# Altium schematic sheet PWM_Isolated.SchDoc: Isolation Motor Driver
size A4; PageSetup: Record=PageOptions|CenterHorizontal=True|CenterVertical=True|PrintScale=0.97|XCorrection=1.00|YCorrection=1.00|PrintKind=0|BorderSize=5000000|LeftOffset=0|BottomOffset=0|Orientation=2|PaperLength=1000|PaperWidth=1000|Scale=100|PaperSource=7|PrintQuality=-3|MediaType=1|DitherType=10|PrintScaleMode=1|PaperKind=A4|PaperIndex=9
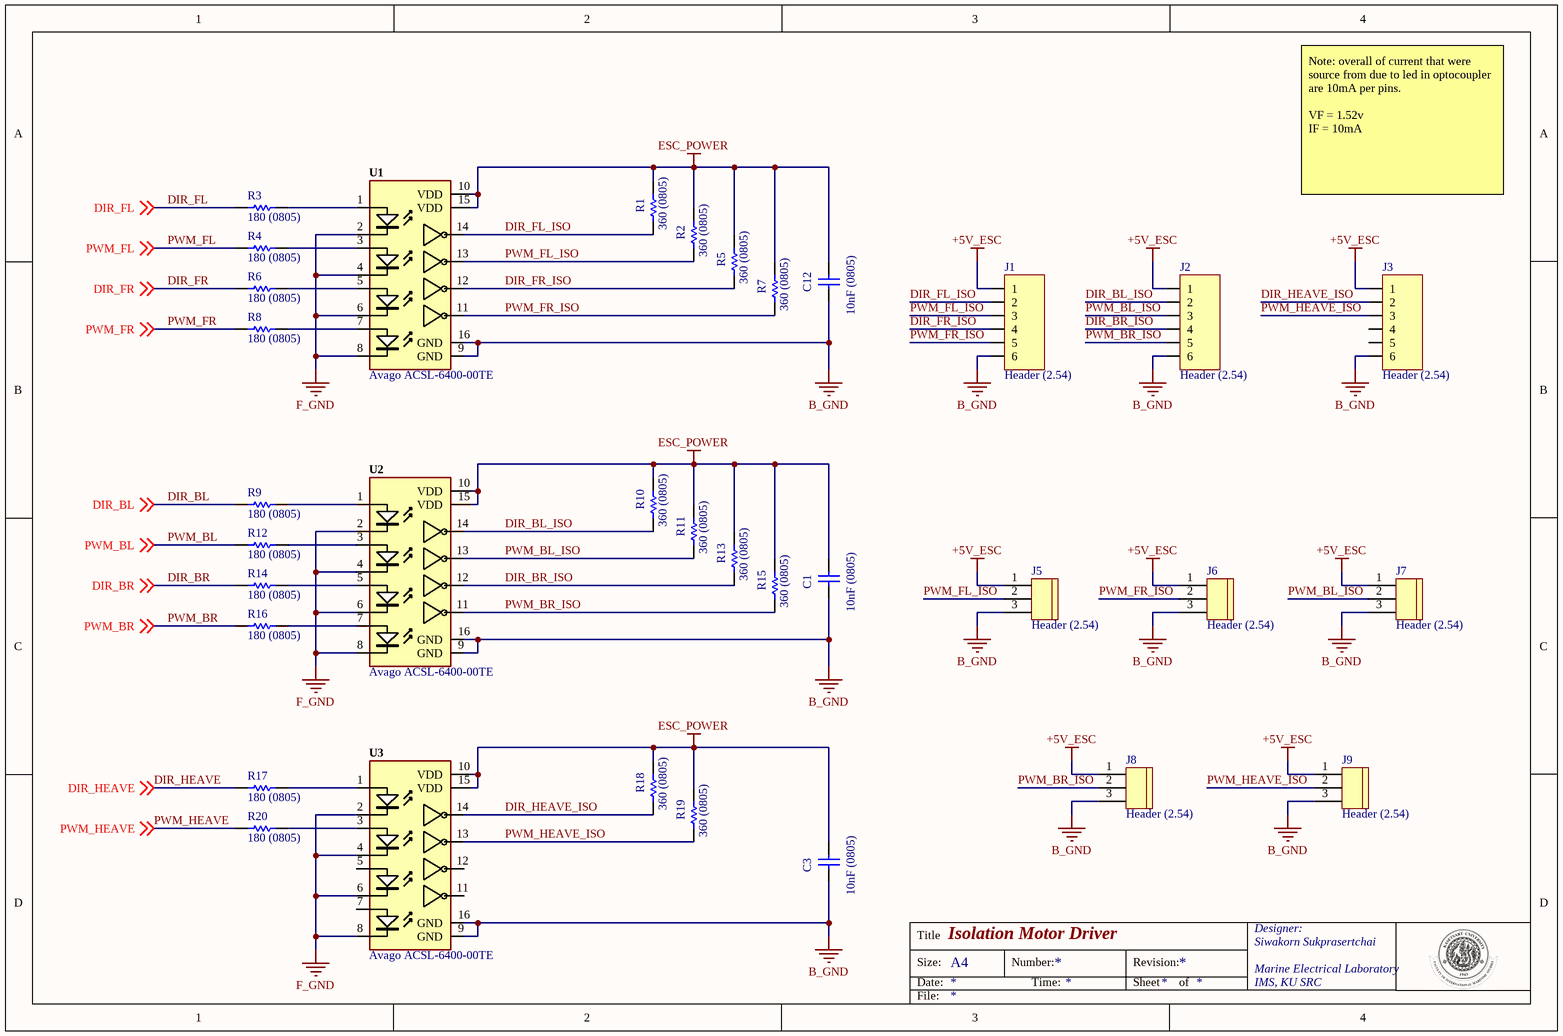
[diagram p0: PWM_Isolated.SchDoc]

## Parts
C1  10nF (0805)  [CAPC2013X94X50NL20T25]
C3  10nF (0805)  [CAPC2013X94X50NL20T25]
C12  10nF (0805)  [CAPC2013X94X50NL20T25]
J1  Header (2.54)  [PCB-cqg2o6bffgevoirlg0wu-1]
J2  Header (2.54)  [PCB-cqg2o6bffgevoirlg0wu-1]
J3  Header (2.54)  [PCB-cqg2o6bffgevoirlg0wu-1]
J5  Header (2.54)  [PCB-euxx5fdf5mehbg45u1ir-1]
J6  Header (2.54)  [PCB-euxx5fdf5mehbg45u1ir-1]
J7  Header (2.54)  [PCB-euxx5fdf5mehbg45u1ir-1]
J8  Header (2.54)  [PCB-euxx5fdf5mehbg45u1ir-1]
J9  Header (2.54)  [PCB-euxx5fdf5mehbg45u1ir-1]
R1  360 (0805)  [RESC2013X60X40NL15T20]
R2  360 (0805)  [RESC2013X60X40NL15T20]
R3  180 (0805)  [RESC2013X60X40NL15T20]
R4  180 (0805)  [RESC2013X60X40NL15T20]
R5  360 (0805)  [RESC2013X60X40NL15T20]
R6  180 (0805)  [RESC2013X60X40NL15T20]
R7  360 (0805)  [RESC2013X60X40NL15T20]
R8  180 (0805)  [RESC2013X60X40NL15T20]
R9  180 (0805)  [RESC2013X60X40NL15T20]
R10  360 (0805)  [RESC2013X60X40NL15T20]
R11  360 (0805)  [RESC2013X60X40NL15T20]
R12  180 (0805)  [RESC2013X60X40NL15T20]
R13  360 (0805)  [RESC2013X60X40NL15T20]
R14  180 (0805)  [RESC2013X60X40NL15T20]
R15  360 (0805)  [RESC2013X60X40NL15T20]
R16  180 (0805)  [RESC2013X60X40NL15T20]
R17  180 (0805)  [RESC2013X60X40NL15T20]
R18  360 (0805)  [RESC2013X60X40NL15T20]
R19  360 (0805)  [RESC2013X60X40NL15T20]
R20  180 (0805)  [RESC2013X60X40NL15T20]
U1  Avago ACSL-6400-00TE  [PCB-bbpchabnk3r0s5lan1zs-1]
U2  Avago ACSL-6400-00TE  [PCB-bbpchabnk3r0s5lan1zs-1]
U3  Avago ACSL-6400-00TE  [PCB-bbpchabnk3r0s5lan1zs-1]

## Nets
+5V_ESC: J1.1 J2.1 J3.1 J5.1 J6.1 J7.1 J8.1 J9.1
B_GND: C1.1 C3.1 C12.1 J1.6 J2.6 J3.6 J5.3 J6.3 J7.3 J8.3 J9.3 U1.9(GND) U1.16(GND) U2.9(GND) U2.16(GND) U3.9(GND) U3.16(GND)
ESC_POWER: C1.2 C3.2 C12.2 R1.1 R2.1 R5.1 R7.1 R10.1 R11.1 R13.1 R15.1 R18.1 R19.1 U1.10(VDD) U1.15(VDD) U2.10(VDD) U2.15(VDD) U3.10(VDD) U3.15(VDD)
F_GND: U1.2 U1.4 U1.6 U1.8 U2.2 U2.4 U2.6 U2.8 U3.2 U3.4 U3.6 U3.8
DIR_BL: R9.2 ; off-sheet DIR_BL
DIR_BL_ISO: J2.2 R10.2 U2.14
DIR_BR: R14.2 ; off-sheet DIR_BR
DIR_BR_ISO: J2.4 R13.2 U2.12
DIR_FL: R3.2 ; off-sheet DIR_FL
DIR_FL_ISO: J1.2 R1.2 U1.14
DIR_FR: R6.2 ; off-sheet DIR_FR
DIR_FR_ISO: J1.4 R5.2 U1.12
DIR_HEAVE: R17.2 ; off-sheet DIR_HEAVE
DIR_HEAVE_ISO: J3.2 R18.2 U3.14
PWM_BL: R12.2 ; off-sheet PWM_BL
PWM_BL_ISO: J2.3 J7.2 R11.2 U2.13
PWM_BR: R16.2 ; off-sheet PWM_BR
PWM_BR_ISO: J2.5 J8.2 R15.2 U2.11
PWM_FL: R4.2 ; off-sheet PWM_FL
PWM_FL_ISO: J1.3 J5.2 R2.2 U1.13
PWM_FR: R8.2 ; off-sheet PWM_FR
PWM_FR_ISO: J1.5 J6.2 R7.2 U1.11
PWM_HEAVE: R20.2 ; off-sheet PWM_HEAVE
PWM_HEAVE_ISO: J3.3 J9.2 R19.2 U3.13
NetR3_1: R3.1 U1.1
NetR4_1: R4.1 U1.3
NetR6_1: R6.1 U1.5
NetR8_1: R8.1 U1.7
NetR9_1: R9.1 U2.1
NetR12_1: R12.1 U2.3
NetR14_1: R14.1 U2.5
NetR16_1: R16.1 U2.7
NetR17_1: R17.1 U3.1
NetR20_1: R20.1 U3.3

Not connected (* = marked no-connect by the designer): J3 4 5; U3 5 7 11 12

## Notes on the sheet
- Note: overall of current that were source from due to led in optocoupler are 10mA per pins.
  VF = 1.52v
  IF = 10mA
- Title
- Size:
- Date:
- A4
- Number:
- Time:
- Revision:
- Sheet
- of
- Designer:
- Siwakorn Sukprasertchai
- Marine Electrical Laboratory
- IMS, KU SRC
- File:

## Library data of the parts
C1 C3 C12 = CMP-16466678-5: CAP CER 10NF 50V 5% X7R 0805; Manufacturer Part Number: 08055C103JAT2A; Case/Package (SI): 2012; Capacitance: 1e-08 F; Voltage Rating (DC): 50.0 V; Dielectric Material: Ceramic Multilayer; Lead-Free Status: Lead Free; Insulation Resistance: 1e+11 ?; Size-Width: 0.0012446 m; REACH SVHC Compliance: No SVHC; Capacitance Tolerance: ±5%; Case/Package: 0805; Mounting Style: Surface Mount; Size-Thickness: 0.0009398 m; Dielectric Characteristic: X7R; Octopart Url: https://octopart.com/08055c103jat2a-avx+interconnect+%2F+elco-39513106; Size-Height: 0.00094 m; Size-Length: 0.0020066 m; Number of Pins: 2; RoHS: Compliant; OctopartID: 02fac9aacb8edd3d
J1-J3 = CMP-c0620b0c5e311fa5-2: Wire-To-Board Connector, Right Angle, AMPMODU Mod II Series, Through Hole, Header, 6, 2.54 mm; Manufacturer Part Number: 826947-6; Number of Contacts: 6; Pin Pitch: 2.54 mm; Gender: Male; Current Rating: 3.00 A; ELV Compliant: Compliant; Octopart URL: http://octopart.com/826947-6-te+connectivity+%2F+amp-40155957; Orientation: Right Angle; Housing Color: Green; Contact Material: Phosphor Bronze; REACH SVHC Compliance: No SVHC; Mounting Style: PCB; Packaging: Box; Housing Material: Thermoplastic; Lifecycle Status: Active; Flammability Rating: UL 94 V-0; RoHS: Compliant; Contact Plating: Tin; OctopartID: c0620b0c5e311fa5
J5-J9 = CMP-b27b7b724c836dbc-1: Pin strip (standard) MTA-100 Total number of pins 3 TE Connectivity 640455-3 1 pc(s); Pin Pitch: 2.54 mm; Shrouded: No; Number of Positions: 3; Mounting Angle: 90.0 °; Voltage Rating (AC): 250 V; ELV Compliant: Compliant; Gender: Male; Lead-Free Status: Lead Free; Octopart URL: http://octopart.com/640455-3-te+connectivity+%2F+amp-252830; Manufacturer Part Number: 640455-3; Orientation: Right Angle; Color: Natural; RoHS: Compliant; Packaging: Bulk; Size-Length: 7.62 mm; Lifecycle Status: Active; Number of Contacts: 3; Housing Color: Natural; Contact Material: Copper Alloy; Contact Plating: Tin; Flammability Rating: UL 94 V-0; Mounting Style: Through Hole; Number of Rows: 1; Size-Height: 5.71 mm; Size-Width: 7.87 mm; Housing Material: Polyester; OctopartID: b27b7b724c836dbc
R1-R20 = CMP-1860549-2: RES SMD 10K OHM 1% 1/3W 0805; Lead-Free Status: Lead Free; Power Rating: 0.125 W; Resistance: 10000.0 ?; Voltage Rating (DC): 150.0 V; Case/Package: 0805; Mounting Style: Surface Mount; Number of Pins: 2; Octopart Url: https://octopart.com/crcw080510k0fkeahp-vishay-42634554; OctopartID: fa6931e9523525ae; Packaging: Cut Tape (CT); REACH SVHC Compliance: No SVHC; Resistance Tolerance: ±1%; RoHS: Compliant
U1-U3 = CMP-6f44a640fcefb083-4: Multi-Channel and Bi-Directional, 15 MBd (typ) Digital Logic Gate Optocoupler; Input Current: 0.015 A; Lead-Free Status: Lead Free; Output Voltage: 7.0 V; Number of Channels: 4; Rise Time: 3.5e-08 s; Data Rate: 15000000.0 bps; Isolation Voltage: 2500.0 V; Input Voltage (DC): 1.52 V; Lifecycle Status: Active; Octopart URL: http://octopart.com/acsl-6400-00te-avago-964301; Number of Pins: 16; Packaging: Tube; RoHS: Compliant; REACH SVHC Compliance: No SVHC; Manufacturer Part Number: ACSL-6400-00TE; Mounting Style: Surface Mount; OctopartID: 6f44a640fcefb083; Case/Package: SOIC